# Altium schematic sheet Voltage_Sens.SchDoc
size A4; SheetNumber: 4; SheetTotal: 6
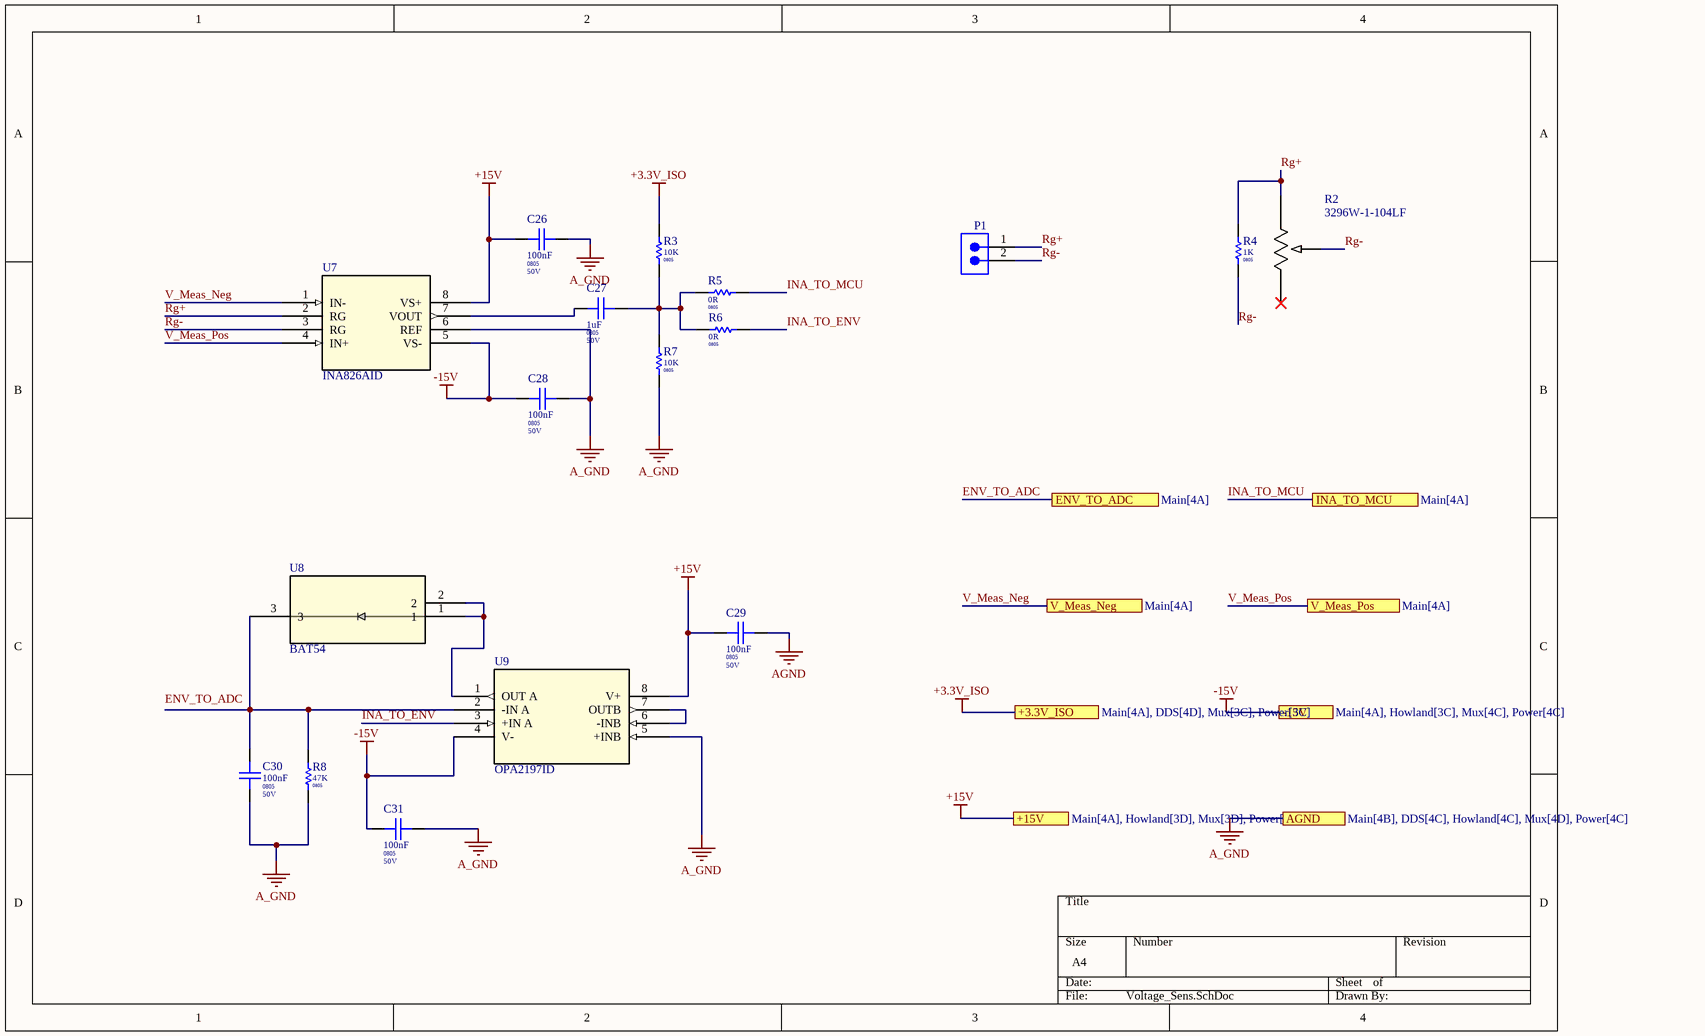
[diagram p0: Voltage_Sens.SchDoc]

## Parts
C26  Package / Case: 0805  Voltage: 50V  [CAPC 0805]  (hidden comment: 100nF)
C27  Package / Case: 0805  Voltage: 50V  [CAPC 0805]  (hidden comment: 1uF)
C28  Package / Case: 0805  Voltage: 50V  [CAPC 0805]  (hidden comment: 100nF)
C29  Package / Case: 0805  Voltage: 50V  [CAPC 0805]  (hidden comment: 100nF)
C30  Package / Case: 0805  Voltage: 50V  [CAPC 0805]  (hidden comment: 100nF)
C31  Package / Case: 0805  Voltage: 50V  [CAPC 0805]  (hidden comment: 100nF)
P1  61300211121  [61300211121]  (value not drawn)
R2  3296W-1-104LF  [POT_3296W]
R3  Package / Case: 0805  [RESC 0805]  (hidden comment: 10K)
R4  Package / Case: 0805  [RESC 0805]  (hidden comment: 1K)
R5  Package / Case: 0805  [RESC 0805]  (hidden comment: 0R)
R6  Package / Case: 0805  [RESC 0805]  (hidden comment: 0R)
R7  Package / Case: 0805  [RESC 0805]  (hidden comment: 10K)
R8  Package / Case: 0805  [RESC 0805]  (hidden comment: 47K)
U7  INA826AID  [D8-M]
U8  BAT54  [SOT-23_3L_ONS-M]
U9  OPA2197ID  [D8_TEX-M]

## Ports
+3.3V_ISO (see Main[4A], DDS[4D], Mux[3C], Power[3C]), +15V (see Main[4A], Howland[3D], Mux[3D], Power[4D]), -15V (see Main[4A], Howland[3C], Mux[4C], Power[4C]), AGND (see Main[4B], DDS[4C], Howland[4C], Mux[4D], Power[4C]), ENV_TO_ADC (see Main[4A]), INA_TO_MCU (see Main[4A]), V_Meas_Neg (see Main[4A]), V_Meas_Pos (see Main[4A])

## Nets
+3.3V_ISO: R3.2 ; port +3.3V_ISO
+15V: C26.2 C29.2 U7.8(VS+) U9.8(V+) ; port +15V
-15V: C28.2 C31.2 U7.5(VS-) U9.4(V-) ; port -15V
A_GND: C26.1 C28.1 C30.2 C31.1 R7.1 R8.1 U7.6(REF) U9.5(+INB) ; port AGND
AGND: C29.1
ENV_TO_ADC: port ENV_TO_ADC
INA_TO_ENV: R6.2 U9.3(+IN_A)
INA_TO_MCU: R5.2 ; port INA_TO_MCU
Rg+: P1.1 R2.1 R4.2 U7.2(RG)
Rg-: P1.2 R2.2 R4.1 U7.3(RG)
V_Meas_Neg: U7.1(IN-) ; port V_Meas_Neg
V_Meas_Pos: U7.4(IN+) ; port V_Meas_Pos
NetC27_1: C27.1 U7.7(VOUT)
NetC27_2: C27.2 R3.1 R5.1 R6.1 R7.2
NetC30_1: C30.1 R8.2 U8.3 U9.2(-IN_A)
NetU8_1: U8.1 U8.2 U9.1(OUT_A)
NetU9_6: U9.6(-INB) U9.7(OUTB)

Not connected (* = marked no-connect by the designer): R2 3*

## Notes on the sheet
- Labels drawn without touching a wire or pin: ENV_TO_ADC

## Library data of the parts
C26 C28-C31 = CAPC0572: Capacitor Ceramic 100nF 50V 0805; Tolerance: %10; Value Rating: nF; Favorites: Favorite; Value: 100nF; Part Number: CAPC0572; Category: Capacitor Ceramic; Values: 100nF 50V
C27 = CAPC0580: Capacitor Ceramic 1uF 50V 0805; Tolerance: %10; Value Rating: uF; Values: 1uF 50V; Favorites: Favorite; Value: 1uF; Part Number: CAPC0580; Category: Capacitor Ceramic
P1 = 61300211121: WR-PHD Pin Header, THT, Vertical, pitch 2.54mm, 1 Row, 2P; Manufacturer: Wurth Elektronik; Contact Resistance: 20mOhm; Rated Current: 3A; Working Voltage: 250V; Withstanding Voltage: 500V; Manufacturer Part Number: 61300211121; Category: Board-to-Board Connectors; Match Code: WR-PHD; ComponentLink1Description: Website Link; ComponentLink1URL: https://www.we-online.com/redexpert/article/61300211121?ad; ComponentLink2Description: Datasheet Link; ComponentLink2URL: https://www.we-online.com/redexpert/spec/61300211121?ad; Mount: Through Hole; Min Operating Temperature: -40°C; Max Operating Temperature: 105°C; Packaging: Bag; Gender: Pin Header; Number of Pins: 2; Number of Rows: 1; Orientation: Vertical; Lead Pitch: 2.54mm
R2 = 3296W-1-104LF: Description; Manufacturer_Name: Bourns Electronics; Copyright: Copyright (C) 2025 Ultra Librarian. All rights reserved.; Manufacturer_Part_Number: 3296W-1-104LF
R3 R7 = R0366: 10K 0805; Part Number: R0366; Tolerance: %5; Power: 1/10W; Value: 10K; Category: Resistor; Values: 10K
R4 = R0342: 1K 0805; Part Number: R0342; Tolerance: %5; Power: 1/10W; Value: 1K; Category: Resistor; Values: 1K
R5 R6 = R0294: 0R 0805; Part Number: R0294; Tolerance: %5; Power: 1/10W; Value: 0R; Category: Resistor; Values: 0R
R8 = R0382: 47K 0805; Part Number: R0382; Tolerance: %5; Power: 1/10W; Value: 47K; Category: Resistor; Values: 47K
U7 = INA826AID: Precision, 200-Î¼A Supply Current, 36-V Supply Instrumentation Amplifier 8-SOIC -40 to 125; Manufacturer_Name: Texas Instruments; Copyright: Copyright (C) 2025 Ultra Librarian. All rights reserved.; Manufacturer_Part_Number: INA826AID; RefDes: RefDes; Type: Type
U8 = BAT54: Description; Manufacturer_Name: onsemi; Copyright: Copyright (C) 2025 Ultra Librarian. All rights reserved.; Manufacturer_Part_Number: BAT54; RefDes: RefDes; Type: Type
U9 = OPA2197ID: Dual 36-V, precision, rail-to-rail input output, low offset voltage op amp 8-SOIC -40 to 125; Manufacturer_Name: Texas Instruments; Copyright: Copyright (C) 2025 Ultra Librarian. All rights reserved.; Manufacturer_Part_Number: OPA2197ID; RefDes: RefDes; Type: Type